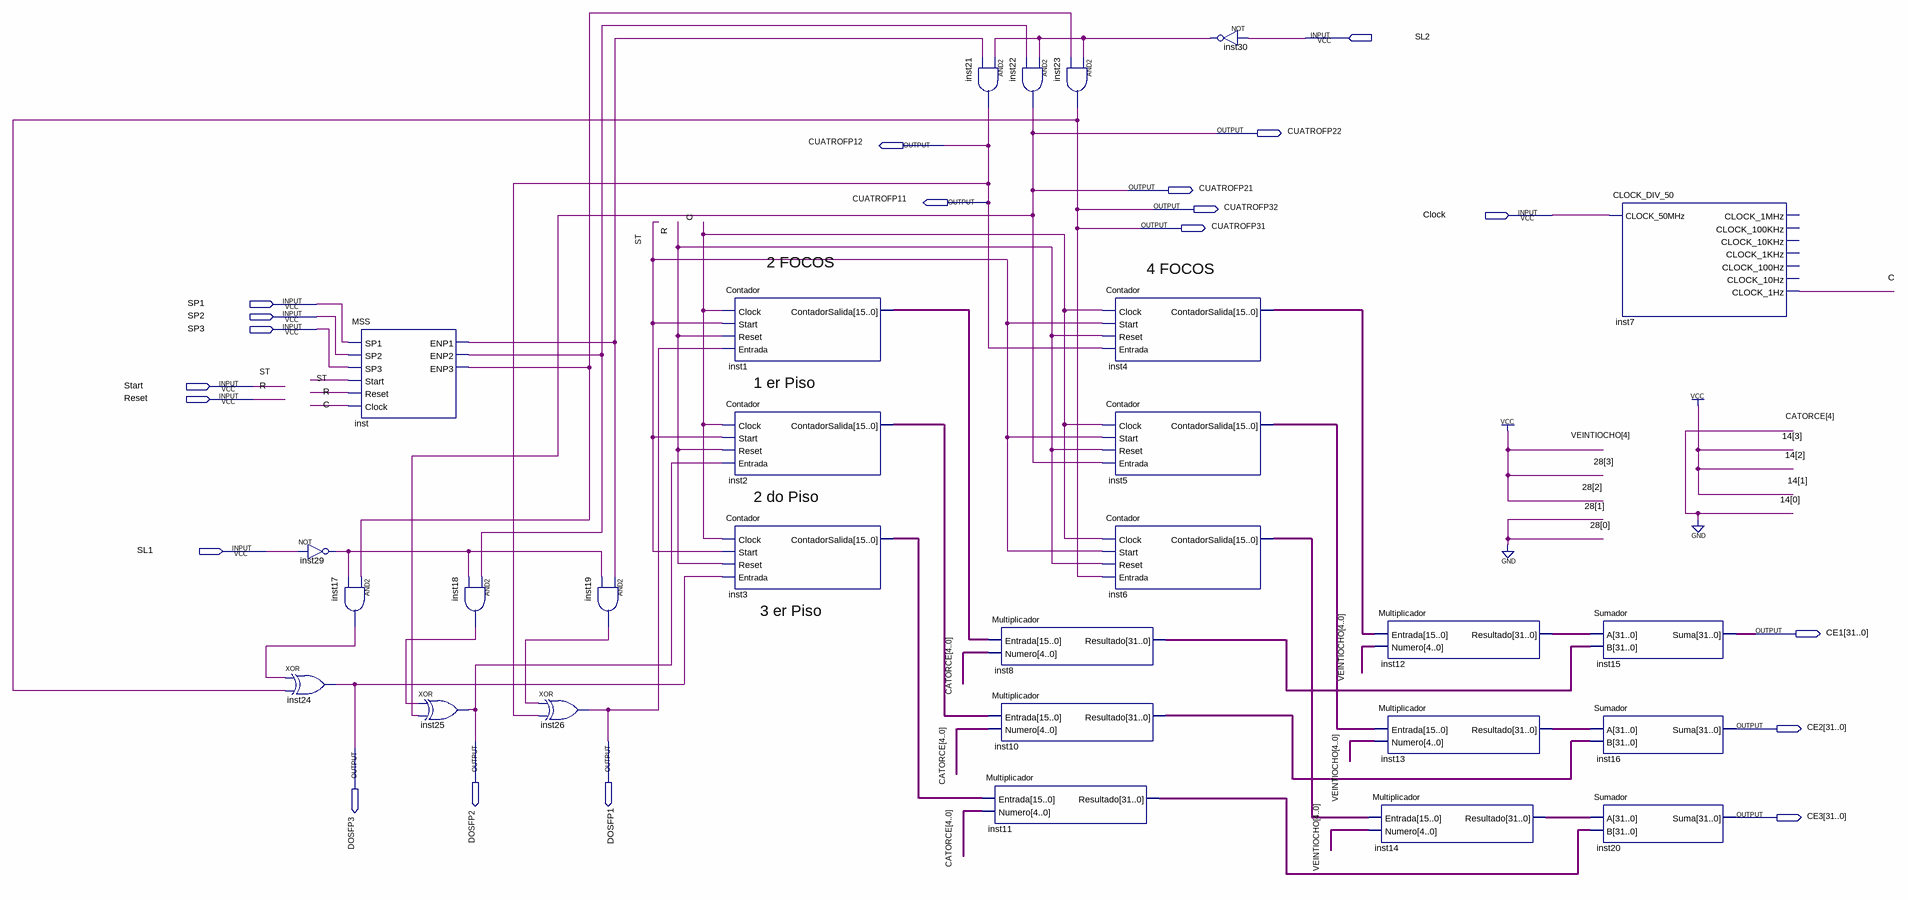
[diagram p0: schematic sheet]
// Quartus schematic ESQUEMATICO.bdf as structural Verilog: 28 symbols, 20 pins
module ESQUEMATICO (
  input  SL2,
  input  Clock,
  input  SP1,
  input  SP2,
  input  SP3,
  input  Start,
  input  Reset,
  input  SL1,
  output CUATROFP22,
  output CUATROFP12,
  output CUATROFP21,
  output CUATROFP11,
  output CUATROFP32,
  output CUATROFP31,
  output [31:0] CE1,
  output [31:0] CE2,
  output DOSFP2,
  output DOSFP1,
  output DOSFP3,
  output [31:0] CE3
);

  wire inst7_clock_1hz, inst17_out, inst18_out, inst19_out, inst29_out, inst30_out, inst_enp1, inst_enp2,
       inst_enp3;
  wire [3:0] CATORCE, VEINTIOCHO;
  wire [15:0] inst1_contadorsalida, inst2_contadorsalida, inst3_contadorsalida, inst4_contadorsalida,
       inst5_contadorsalida, inst6_contadorsalida;
  wire [31:0] inst8_resultado, inst10_resultado, inst11_resultado, inst12_resultado, inst13_resultado,
       inst14_resultado;

  not inst29 (inst29_out, SL1);
  xor inst24 (DOSFP3, inst17_out, CUATROFP31);
  MSS inst (
    .SP1(SP1), .SP2(SP2), .SP3(SP3), .Start(Start), .Reset(Reset), .Clock(Clock), .ENP1(inst_enp1),
    .ENP2(inst_enp2), .ENP3(inst_enp3));
  and inst17 (inst17_out, inst_enp3, inst29_out);
  xor inst25 (DOSFP2, inst18_out, CUATROFP21);
  and inst18 (inst18_out, inst_enp2, inst29_out);
  xor inst26 (DOSFP1, inst19_out, CUATROFP11);
  and inst19 (inst19_out, inst_enp1, inst29_out);
  Contador inst1 (.Clock(Clock), .Start(Start), .Reset(Reset), .Entrada(DOSFP1), .ContadorSalida(inst1_contadorsalida));
  Contador inst2 (.Clock(Clock), .Start(Start), .Reset(Reset), .Entrada(DOSFP2), .ContadorSalida(inst2_contadorsalida));
  Contador inst3 (.Clock(Clock), .Start(Start), .Reset(Reset), .Entrada(DOSFP3), .ContadorSalida(inst3_contadorsalida));
  and inst21 (CUATROFP11, inst30_out, inst_enp1);
  Multiplicador inst8 (.Entrada(inst1_contadorsalida), .Numero({1'b0, CATORCE}), .Resultado(inst8_resultado));
  Multiplicador inst10 (.Entrada(inst2_contadorsalida), .Numero({1'b0, CATORCE}), .Resultado(inst10_resultado));
  Multiplicador inst11 (.Entrada(inst3_contadorsalida), .Numero({1'b0, CATORCE}), .Resultado(inst11_resultado));
  and inst22 (CUATROFP21, inst30_out, inst_enp2);
  and inst23 (CUATROFP31, inst30_out, inst_enp3);
  Contador inst4 (
    .Clock(Clock), .Start(Start), .Reset(Reset), .Entrada(CUATROFP11), .ContadorSalida(inst4_contadorsalida));
  Contador inst5 (
    .Clock(Clock), .Start(Start), .Reset(Reset), .Entrada(CUATROFP21), .ContadorSalida(inst5_contadorsalida));
  Contador inst6 (
    .Clock(Clock), .Start(Start), .Reset(Reset), .Entrada(CUATROFP31), .ContadorSalida(inst6_contadorsalida));
  not inst30 (inst30_out, SL2);
  Multiplicador inst12 (.Entrada(inst4_contadorsalida), .Numero({1'b1, VEINTIOCHO}), .Resultado(inst12_resultado));
  Multiplicador inst13 (.Entrada(inst5_contadorsalida), .Numero({1'b1, VEINTIOCHO}), .Resultado(inst13_resultado));
  Multiplicador inst14 (.Entrada(inst6_contadorsalida), .Numero({1'b1, VEINTIOCHO}), .Resultado(inst14_resultado));
  CLOCK_DIV_50 inst7 (
    .CLOCK_50MHz(Clock), .CLOCK_1Hz(inst7_clock_1hz));  // open: CLOCK_1MHz, CLOCK_100KHz, CLOCK_10KHz, CLOCK_1KHz, CLOCK_100Hz, CLOCK_10Hz
  Sumador inst15 (.A(inst12_resultado), .B(inst8_resultado), .Suma(CE1));
  Sumador inst16 (.A(inst13_resultado), .B(inst10_resultado), .Suma(CE2));
  Sumador inst20 (.A(inst14_resultado), .B(inst11_resultado), .Suma(CE3));

  assign CUATROFP12 = CUATROFP11;
  assign CUATROFP22 = CUATROFP21;
  assign CUATROFP32 = CUATROFP31;

  // Other names for the same wires on the sheet: C = Clock; R = Reset; ST = Start

  // Notes on the sheet:
  //   2 FOCOS
  //   4 FOCOS
  //   1 er Piso
  //   2 do Piso
  //   3 er Piso
endmodule
